# Altium schematic sheet MotorControl.SchDoc: Motor Control
size A4; DocumentNumber: MB1167; Revision: B.1; SheetNumber: 13; SheetTotal: 17; Project: STM327x6G-EVAL
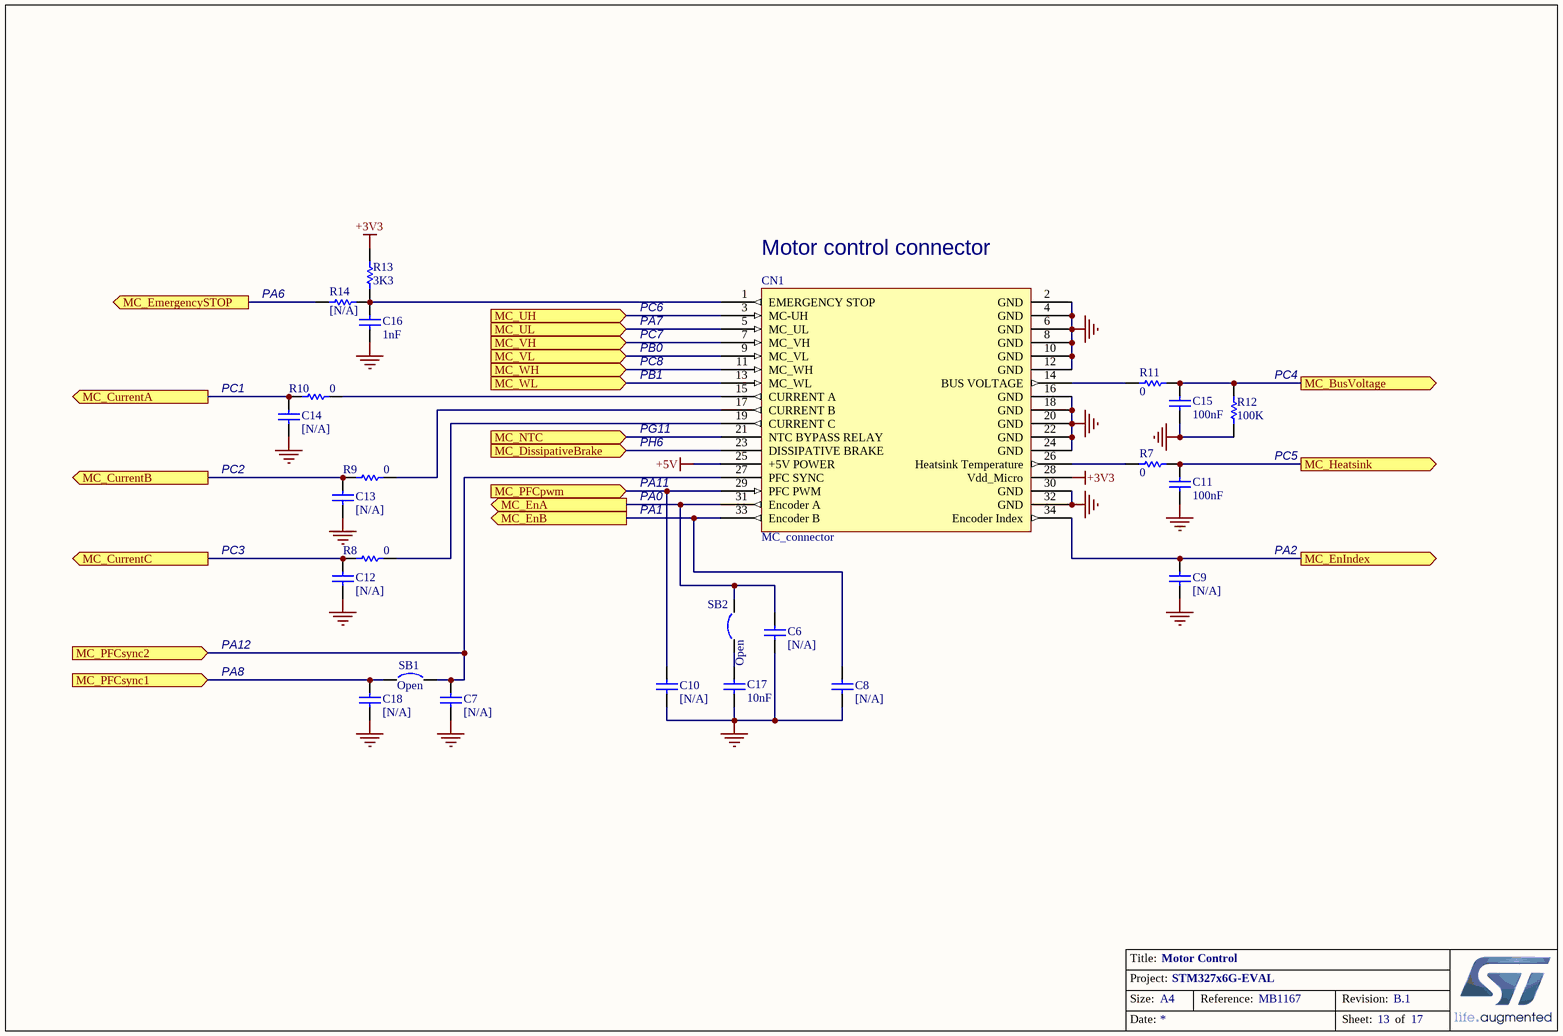
[diagram p0: MotorControl.SchDoc]

## Parts
C6  [N/A]  [0603C]
C7  [N/A]  [0603C]
C8  [N/A]  [0603C]
C9  [N/A]  [0603C]
C10  [N/A]  [0603C]
C11  100nF  [0603C]
C12  [N/A]  [0603C]
C13  [N/A]  [0603C]
C14  [N/A]  [0603C]
C15  100nF  [0603C]
C16  1nF  [0603C]
C17  10nF  [0603C]
C18  [N/A]  [0603C]
CN1  MC_connector  [IDC34S]
R7  0  [0603R]
R8  0  [0603R]
R9  0  [0603R]
R10  0  [0603R]
R11  0  [0603R]
R12  100K  [0603R]
R13  3K3  [0603R]
R14  [N/A]  [0603R]
SB1  Open  [SB_0603]
SB2  Open  [SB_0603]

## Ports
MC_BusVoltage (out), MC_CurrentA (out), MC_CurrentB (out), MC_CurrentC (out), MC_DissipativeBrake (in), MC_EmergencySTOP (out), MC_EnA (out), MC_EnB (out), MC_EnIndex (out), MC_Heatsink (out), MC_NTC (in), MC_PFCpwm (in), MC_PFCsync1 (in), MC_PFCsync2 (in), MC_UH (in), MC_UL (in), MC_VH (in), MC_VL (in), MC_WH (in), MC_WL (in)

## Nets
+3V3: CN1.28(Vdd_Micro) R13.2
+5V: CN1.25(+5V_POWER)
GND: C6.1 C7.1 C8.1 C9.1 C10.1 C11.2 C12.1 C13.1 C14.1 C15.2 C16.1 C17.2 C18.1 CN1.2(GND) CN1.4(GND) CN1.6(GND) CN1.8(GND) CN1.10(GND) CN1.12(GND) CN1.16(GND) CN1.18(GND) CN1.20(GND) CN1.22(GND) CN1.24(GND) CN1.30(GND) CN1.32(GND) R12.2
MC_BusVoltage: C15.1 R11.2 R12.1 ; port MC_BusVoltage
MC_CurrentA: C14.2 R10.1 ; port MC_CurrentA
MC_CurrentB: C13.2 R9.1 ; port MC_CurrentB
MC_CurrentC: C12.2 R8.1 ; port MC_CurrentC
MC_DissipativeBrake: CN1.23(DISSIPATIVE_BRAKE) ; port MC_DissipativeBrake
MC_EmergencySTOP: R14.2 ; port MC_EmergencySTOP
MC_EnA: C6.2 CN1.31(Encoder_A) SB2.2 ; port MC_EnA
MC_EnB: C8.2 CN1.33(Encoder_B) ; port MC_EnB
MC_EnIndex: C9.2 CN1.34(Encoder_Index) ; port MC_EnIndex
MC_Heatsink: C11.1 R7.2 ; port MC_Heatsink
MC_NTC: CN1.21(NTC_BYPASS_RELAY) ; port MC_NTC
MC_PFCpwm: C10.2 CN1.29(PFC_PWM) ; port MC_PFCpwm
MC_PFCsync1: C18.2 SB1.1 ; port MC_PFCsync1
MC_PFCsync2: C7.2 CN1.27(PFC_SYNC) SB1.2 ; port MC_PFCsync2
MC_UH: CN1.3(MC-UH) ; port MC_UH
MC_UL: CN1.5(MC_UL) ; port MC_UL
MC_VH: CN1.7(MC_VH) ; port MC_VH
MC_VL: CN1.9(MC_VL) ; port MC_VL
MC_WH: CN1.11(MC_WH) ; port MC_WH
MC_WL: CN1.13(MC_WL) ; port MC_WL
NetC16_2: C16.2 CN1.1(EMERGENCY_STOP) R13.1 R14.1
NetC17_1: C17.1 SB2.1
NetCN1_14: CN1.14(BUS_VOLTAGE) R11.1
NetCN1_15: CN1.15(CURRENT_A) R10.2
NetCN1_17: CN1.17(CURRENT_B) R9.2
NetCN1_19: CN1.19(CURRENT_C) R8.2
NetCN1_26: CN1.26(Heatsink_Temperature) R7.1

## Notes on the sheet
- (near R14) PA6
- PC6
- (near CN1) Motor control connector
- PA7
- PB0
- PB1
- PC7
- PC8
- (near R12) PC4
- PC1
- PG11
- PH6
- PC2
- PA1
- PA0
- PA11
- (near R12) PC5
- PC3
- PA2
- PA12
- PA8
- Title:
- Project:
- Size:
- Date:
- A4
- Reference:
- Sheet:
- Revision:
- of

## Library data of the parts
C6-C10 C12-C14 C18 = cap: Capacitor; Value: 100pF; Published: 8-Jun-2000; Revision: July-2002: Re-released for DXP Platform.; Publisher: Altium Limited
C11 C15 = Cap: Capacitor; Value: 10nF; Published: 8-Jun-2000; Revision: July-2002: Re-released for DXP Platform.; Publisher: Altium Limited
C16 C17 = CAP: Capacitor; Value: 100pF; Published: 8-Jun-2000; Revision: July-2002: Re-released for DXP Platform.; Publisher: Altium Limited
R7-R11 R13 R14 = Res1: Resistor; Value: 1K; Published: 8-Jun-2000; Revision: July-2002: Re-released for DXP Platform.; Publisher: Altium Limited
R12 = res1: Resistor; Value: 1K; Published: 8-Jun-2000; Revision: July-2002: Re-released for DXP Platform.; Publisher: Altium Limited
SB1 SB2 = Circuit Breaker: Published: 24-Mar-1999; Revision: July-2002: Re-released for DXP Platform.; Publisher: Altium Limited